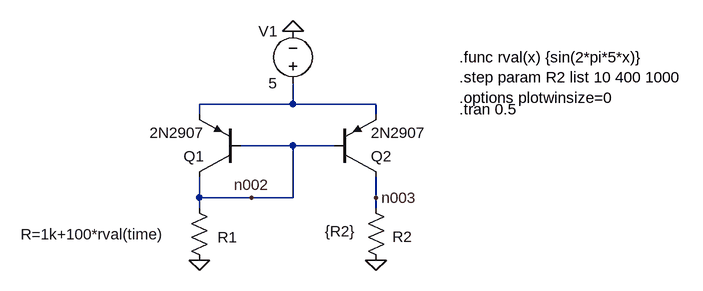
[diagram p0: schematic c02ex17s01.asc]
c02ex17s01.asc, the LTspice schematic file:
Version 4
SHEET 1 880 680
WIRE 144 32 144 0
WIRE 144 32 0 32
WIRE 272 32 144 32
WIRE 0 48 0 32
WIRE 272 48 272 32
WIRE 144 96 64 96
WIRE 208 96 144 96
WIRE 0 176 0 144
WIRE 80 176 0 176
WIRE 144 176 144 96
WIRE 144 176 80 176
WIRE 272 176 272 144
WIRE 0 192 0 176
WIRE 272 192 272 176
FLAG 144 -80 0
FLAG 0 272 0
FLAG 272 272 0
FLAG 80 176 n002
FLAG 272 176 n003
SYMBOL pnp 64 144 R180
SYMATTR InstName Q1
SYMATTR Value 2N2907
SYMBOL pnp 208 144 M180
SYMATTR InstName Q2
SYMATTR Value 2N2907
SYMBOL voltage 144 16 R180
WINDOW 0 24 96 Left 2
WINDOW 3 24 16 Left 2
WINDOW 123 0 0 Left 0
WINDOW 39 0 0 Left 0
SYMATTR InstName V1
SYMATTR Value 5
SYMBOL res -16 176 R0
WINDOW 0 44 61 Left 2
WINDOW 3 -259 56 Left 2
SYMATTR InstName R1
SYMATTR Value R=1k+100*rval(time)
SYMBOL res 256 176 R0
WINDOW 0 41 60 Left 2
WINDOW 3 -63 52 Left 2
SYMATTR InstName R2
SYMATTR Value {R2}
TEXT 400 40 Left 2 !.tran 0.5
TEXT 400 -40 Left 2 !.func rval(x) {sin(2*pi*5*x)}\n.step param R2 list 10 400 1000\n.options plotwinsize=0

The netlist it stands for:
* c02ex17s01.asc
Q1 n002 n002 N001 0 2N2907
Q2 n003 n002 N001 0 2N2907
V1 N001 0 5
R1 n002 0 R=1k+100*rval(time)
R2 n003 0 {R2}
.model NPN NPN
.model PNP PNP
.lib standard.bjt
.tran 0.5
.func rval(x) {sin(2*pi*5*x)}
.step param R2 list 10 400 1000
.options plotwinsize=0
.backanno
.end